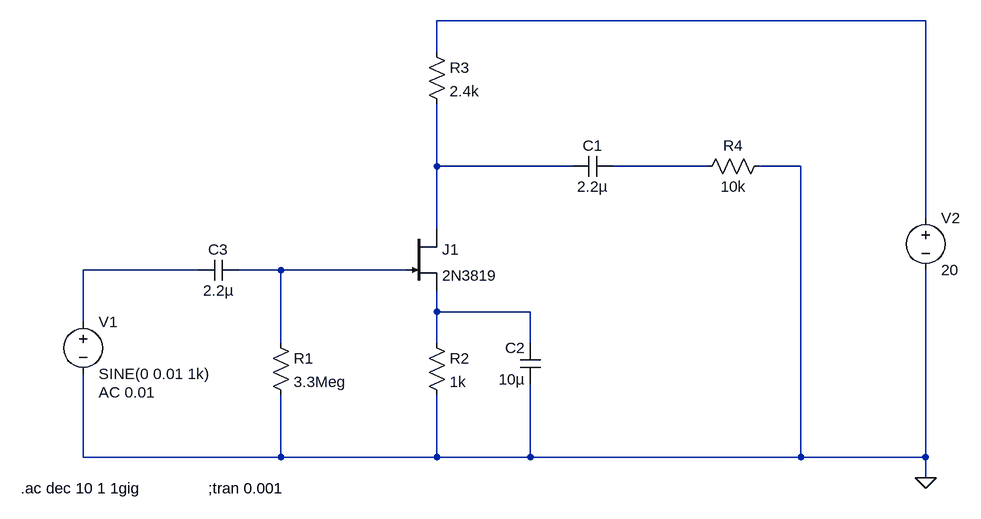
[diagram p0: schematic jfet_amplifier.asc]
jfet_amplifier.asc, the LTspice schematic file:
Version 4
SHEET 1 952 680
WIRE 896 -192 144 -192
WIRE 144 -144 144 -192
WIRE 144 32 144 -64
WIRE 352 32 144 32
WIRE 560 32 416 32
WIRE 704 32 640 32
WIRE 896 112 896 -192
WIRE 144 128 144 32
WIRE -224 192 -400 192
WIRE -96 192 -160 192
WIRE 96 192 -96 192
WIRE 144 256 144 224
WIRE 288 256 144 256
WIRE -400 272 -400 192
WIRE -96 304 -96 192
WIRE 144 304 144 256
WIRE 288 304 288 256
WIRE -400 480 -400 352
WIRE -96 480 -96 384
WIRE -96 480 -400 480
WIRE 144 480 144 384
WIRE 144 480 -96 480
WIRE 288 480 288 368
WIRE 288 480 144 480
WIRE 704 480 704 32
WIRE 704 480 288 480
WIRE 896 480 896 192
WIRE 896 480 704 480
WIRE 896 512 896 480
FLAG 896 512 0
SYMBOL njf 96 128 R0
SYMATTR InstName J1
SYMATTR Value 2N3819
SYMBOL res -112 288 R0
SYMATTR InstName R1
SYMATTR Value 3.3Meg
SYMBOL res 128 288 R0
SYMATTR InstName R2
SYMATTR Value 1k
SYMBOL res 128 -160 R0
SYMATTR InstName R3
SYMATTR Value 2.4k
SYMBOL res 656 16 R90
WINDOW 0 0 56 VBottom 2
WINDOW 3 32 56 VTop 2
SYMATTR InstName R4
SYMATTR Value 10k
SYMBOL cap 416 16 R90
WINDOW 0 0 32 VBottom 2
WINDOW 3 32 32 VTop 2
SYMATTR InstName C1
SYMATTR Value 2.2µ
SYMBOL cap 304 368 R180
WINDOW 0 24 56 Left 2
WINDOW 3 24 8 Left 2
SYMATTR InstName C2
SYMATTR Value 10µ
SYMBOL cap -224 208 R270
WINDOW 0 32 32 VTop 2
WINDOW 3 0 32 VBottom 2
SYMATTR InstName C3
SYMATTR Value 2.2µ
SYMBOL voltage -400 256 R0
WINDOW 123 24 124 Left 2
WINDOW 39 0 0 Left 0
SYMATTR Value2 AC 0.01
SYMATTR InstName V1
SYMATTR Value SINE(0 0.01 1k)
SYMBOL voltage 896 96 R0
WINDOW 123 0 0 Left 0
WINDOW 39 0 0 Left 0
SYMATTR InstName V2
SYMATTR Value 20
TEXT -496 528 Left 2 !.ac dec 10 1 1gig
TEXT -208 528 Left 2 !;tran 0.001

The netlist it stands for:
* jfet_amplifier.asc
J1 N002 N005 N006 2N3819
R1 N005 0 3.3Meg
R2 N006 0 1k
R3 N001 N002 2.4k
R4 0 N003 10k
C1 N003 N002 2.2µ
C2 0 N006 10µ
C3 N004 N005 2.2µ
V1 N004 0 SINE(0 0.01 1k) AC 0.01
V2 N001 0 20
.model NJF NJF
.model PJF PJF
.lib standard.jft
.ac dec 10 1 1gig
;tran 0.001
.backanno
.end